# EAGLE design preamp (EAGLE 8.2.2)
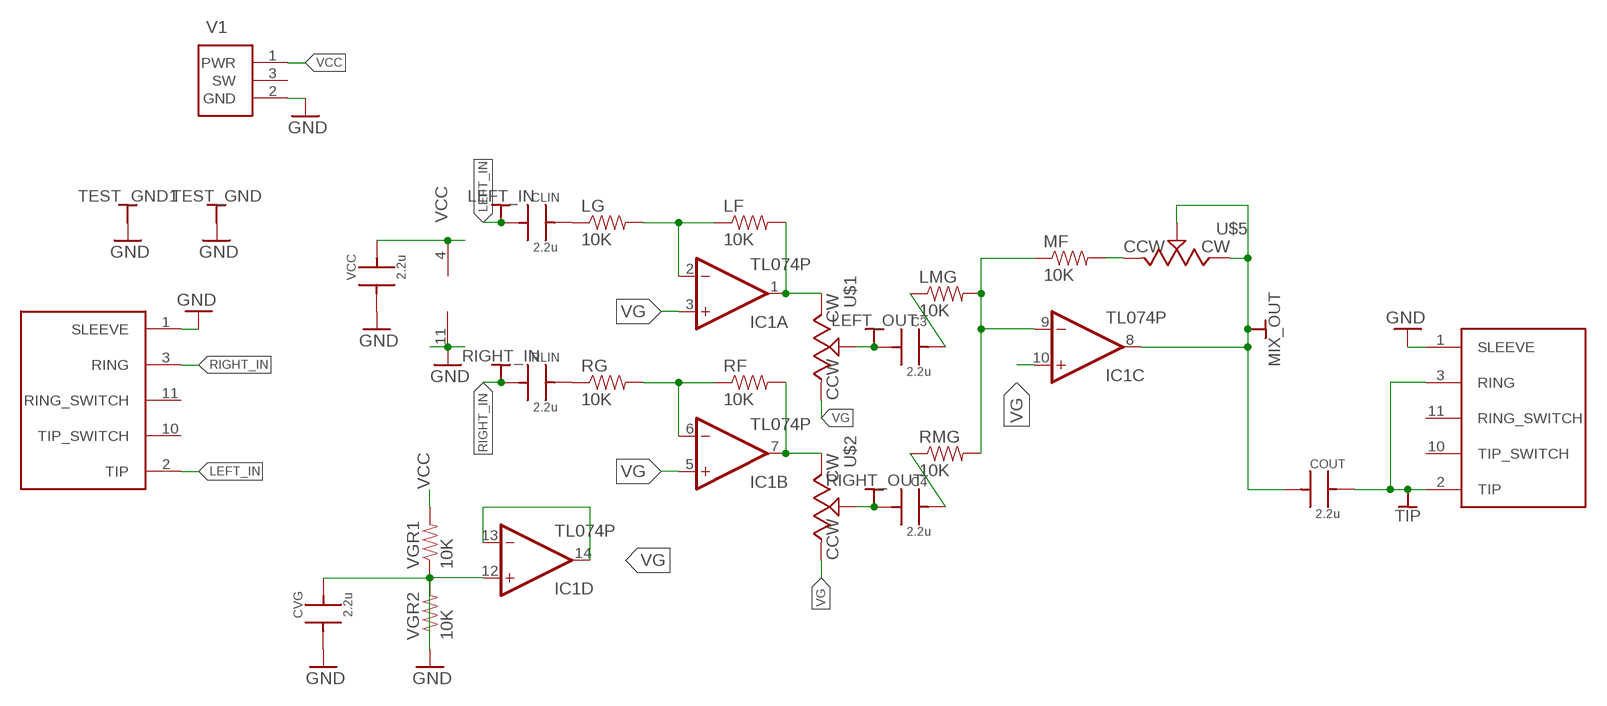
[diagram p0: schematic, sheet 1]

## Parts
C3  2.2u  CAP  [C322]
C4  2.2u  CAP  [C322]
CLIN  2.2u  CAP  [C322]
COUT  2.2u  CAP  [C322]
CVG  2.2u  CAP  [C322]
IC1  TL074P  [DIL14]
LEFT_IN  TEST_POINTMINIATURE  [PLATED_HOLE_1.02MM]
LEFT_OUT  TEST_POINTMINIATURE  [PLATED_HOLE_1.02MM]
LF  10K  RESISTORPTH-1/4W  [AXIAL-0.4]
LG  10K  RESISTORPTH-1/4W  [AXIAL-0.4]
LMG  10K  RESISTORPTH-1/4W  [AXIAL-0.4]
MF  10K  RESISTORPTH-1/4W  [AXIAL-0.4]
MIX_OUT  TEST_POINTMINIATURE  [PLATED_HOLE_1.02MM]
RF  10K  RESISTORPTH-1/4W  [AXIAL-0.4]
RG  10K  RESISTORPTH-1/4W  [AXIAL-0.4]
RIGHT_IN  TEST_POINTMINIATURE  [PLATED_HOLE_1.02MM]
RIGHT_OUT  TEST_POINTMINIATURE  [PLATED_HOLE_1.02MM]
RLIN  2.2u  CAP  [C322]
RMG  10K  RESISTORPTH-1/4W  [AXIAL-0.4]
TEST_GND  TEST_POINTMINIATURE  [PLATED_HOLE_1.02MM]
TEST_GND1  TEST_POINTMINIATURE  [PLATED_HOLE_1.02MM]
TIP  TEST_POINTMINIATURE  [PLATED_HOLE_1.02MM]
U$1  POTENTIOMETER3362P  [3362P]
U$2  POTENTIOMETER3362P  [3362P]
U$3  AUDIO_5_CONDUCTOR  [SJ1-3525N]
U$4  AUDIO_5_CONDUCTOR  [SJ1-3525N]
U$5  POTENTIOMETER3362P  [3362P]
V1  POWER_JACK  [PJ-102AH]
VCC  2.2u  CAP  [C322]
VGR1  10K  RESISTORPTH-1/4W  [AXIAL-0.4]
VGR2  10K  RESISTORPTH-1/4W  [AXIAL-0.4]

## Nets
GND: CVG.1 IC1.11(P:V-) TEST_GND1.1 TEST_GND.1 U$3.1(SLEEVE) U$4.1(SLEEVE) V1.2(GND) VCC.1 VGR2.P$2
LEFT_IN: CLIN.1 LEFT_IN.1 U$3.2(TIP)
N$1: IC1.2(A:-IN) LF.P$1 LG.P$2
N$2: IC1.6(B:-IN) RF.P$1 RG.P$2
N$3: IC1.7(B:OUT) RF.P$2 U$2.3(CW)
N$4: IC1.1(A:OUT) LF.P$2 U$1.3(CW)
N$5: RG.P$1 RLIN.2
N$6: CLIN.2 LG.P$1
N$7: CVG.2 IC1.12(D:+IN) VGR1.P$1 VGR2.P$1
N$8: C3.1 LEFT_OUT.1 U$1.2(WIPER)
N$9: C3.2 LMG.P$1
N$10: C4.2 RMG.P$1
N$11: IC1.9(C:-IN) LMG.P$2 MF.P$1 RMG.P$2
N$12: C4.1 RIGHT_OUT.1 U$2.2(WIPER)
N$13: COUT.1 IC1.8(C:OUT) MIX_OUT.1 U$5.2(WIPER) U$5.3(CW)
N$14: COUT.2 TIP.1 U$4.2(TIP) U$4.3(RING)
N$15: MF.P$2 U$5.1(CCW)
RIGHT_IN: RIGHT_IN.1 RLIN.1 U$3.3(RING)
VCC: IC1.4(P:V+) V1.1(PWR) VCC.2 VGR1.P$2
VG: IC1.3(A:+IN) IC1.5(B:+IN) IC1.10(C:+IN) IC1.13(D:-IN) IC1.14(D:OUT) U$1.1(CCW) U$2.1(CCW)
Unconnected: U$3.10(TIP_SWITCH) U$3.11(RING_SWITCH) U$4.10(TIP_SWITCH) U$4.11(RING_SWITCH)

## Power pins joined to a net without a drawn wire
SW: V1.3(SW)

## Library data of the parts
C3 C4 CLIN COUT CVG RLIN VCC = KEMET:CAP
IC1 = linear:TL074: OP AMP
LEFT_IN LEFT_OUT MIX_OUT RIGHT_IN RIGHT_OUT TEST_GND TEST_GND1 TIP = Keystone:TEST_POINT
LF LG LMG MF RF RG RMG VGR1 VGR2 = SparkFun-Passives:RESISTOR: Resistor Basic schematic elements and footprints for 0603, 1206, and PTH resistors.
U$1 U$2 U$5 = Bourns:POTENTIOMETER
U$3 U$4 = CUI:AUDIO_5_CONDUCTOR
V1 = CUI:POWER_JACK: Standard Power Jack with Switch

## Net classes
0 default: width 0.406 mm

## Board
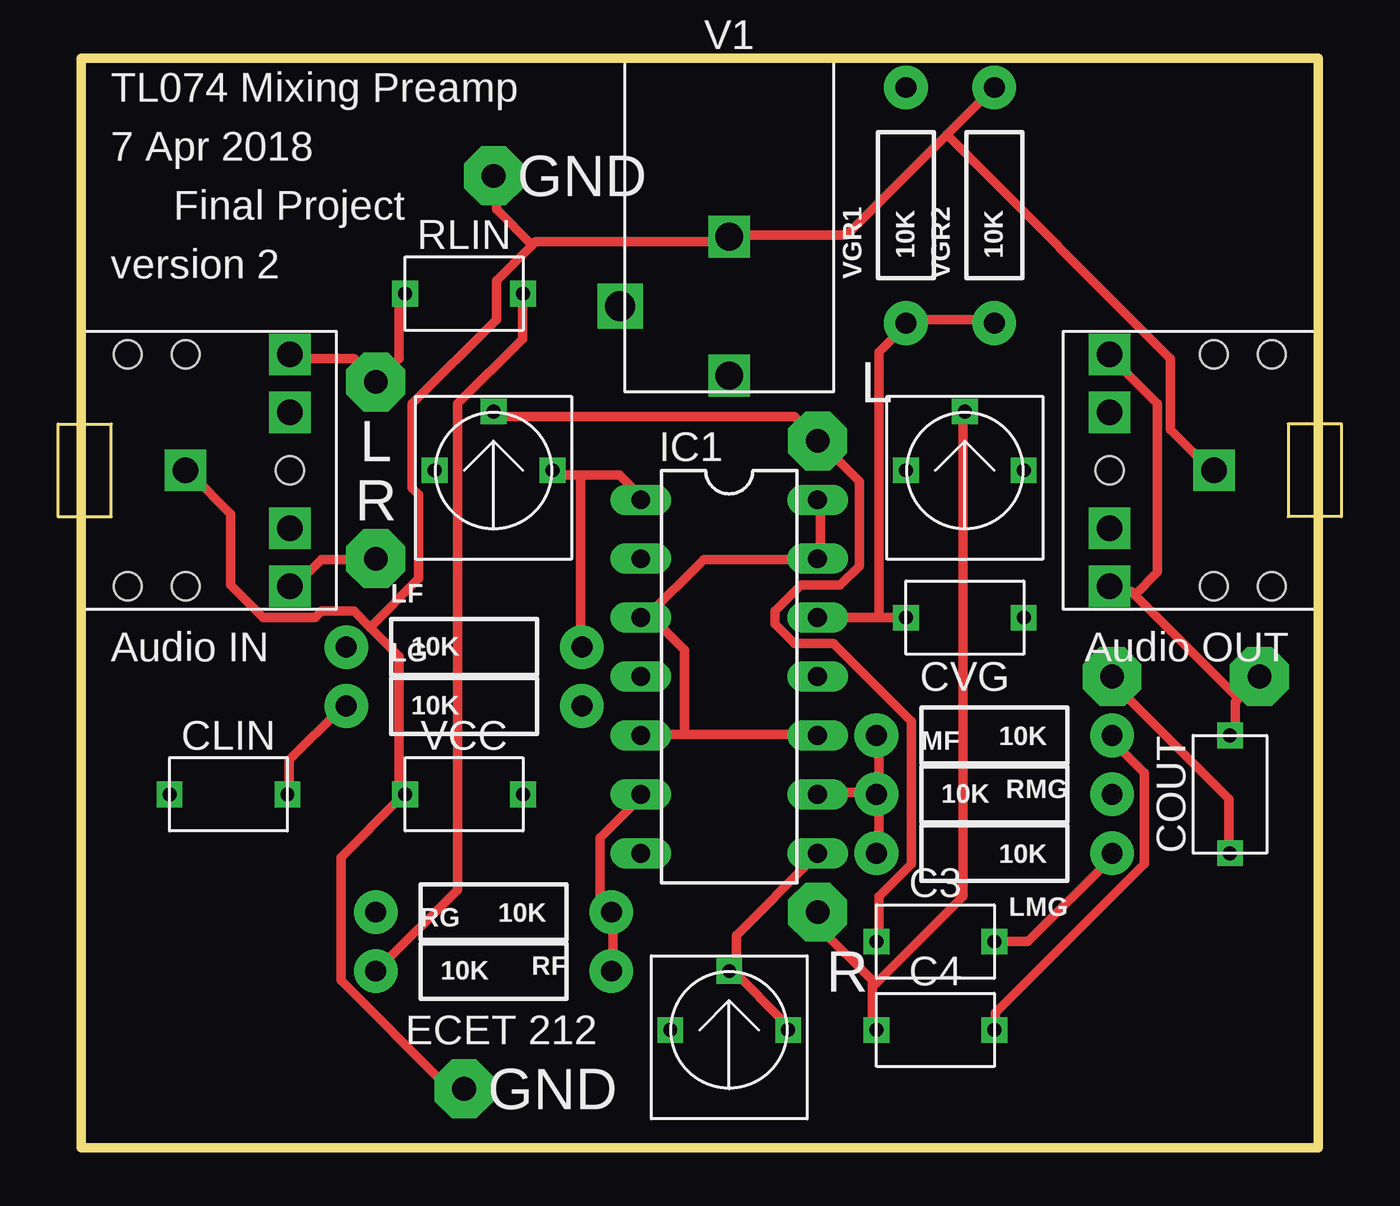
[diagram p1: board, top side]
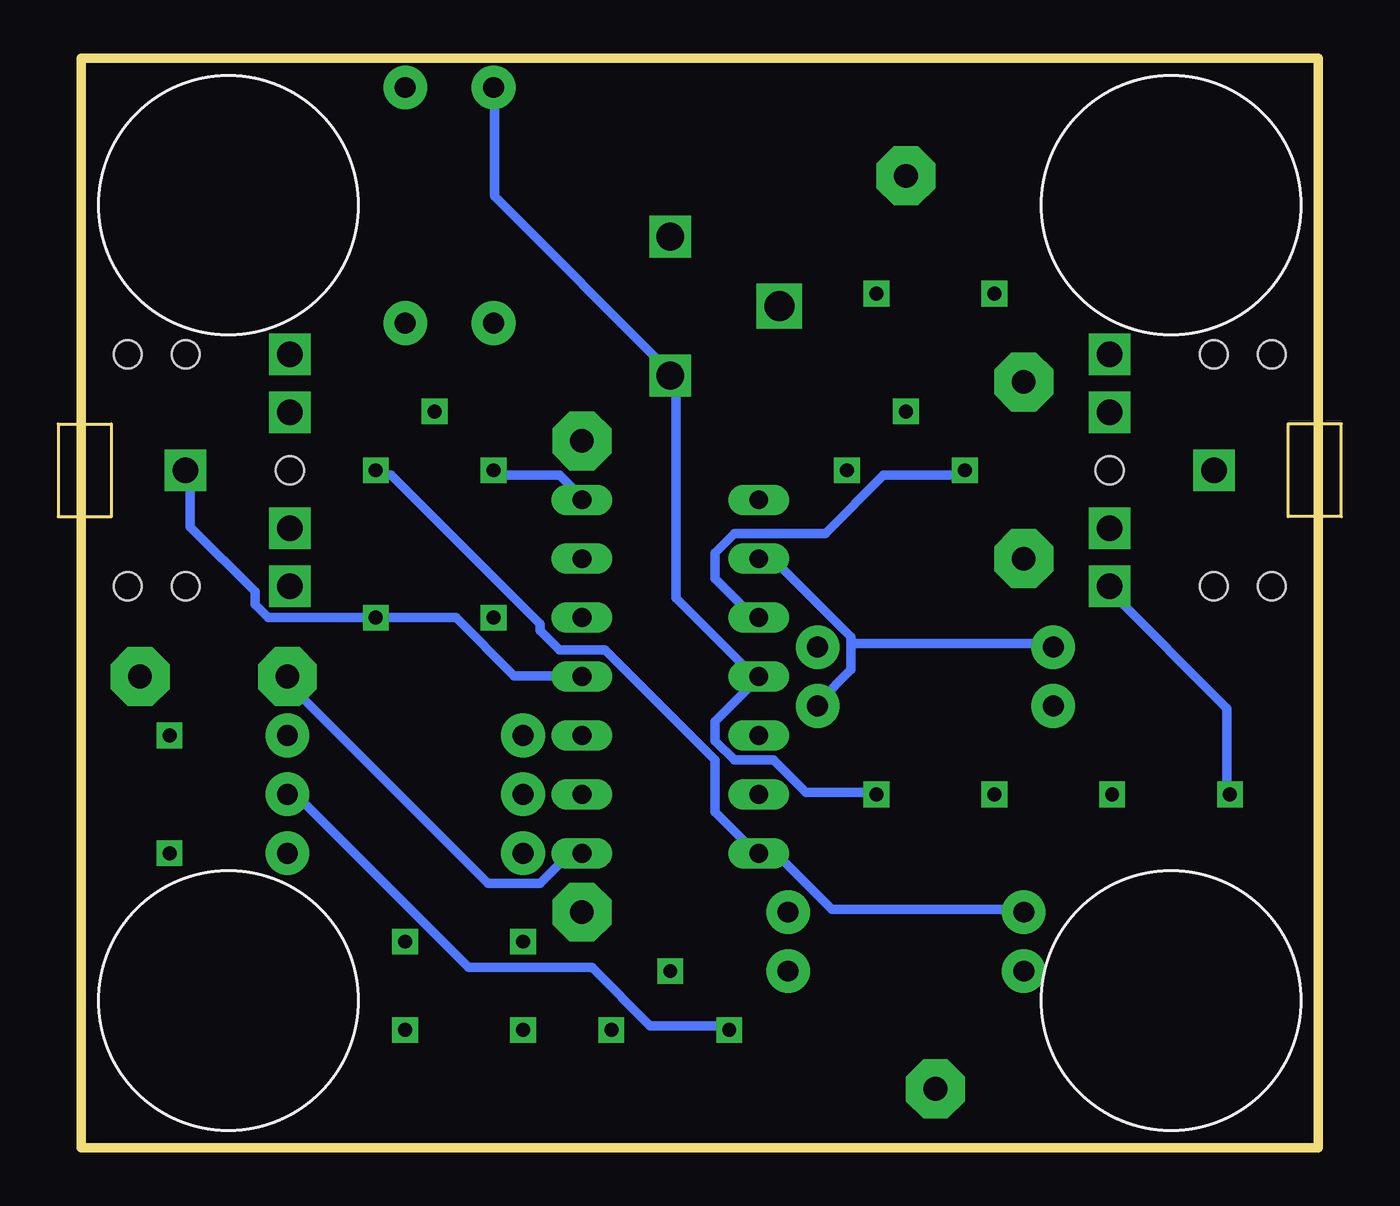
[diagram p2: board, bottom side, seen from below]

Size 53.34 x 46.99 mm. Coordinates in mm from the lower left corner, seen from the top.
Outline: 0,0 0,46.99 53.34,46.99 53.34,0 0,0
Copper layers (1*16): Top 0.035mm / dielectric 1.5mm / Bottom 0.035mm
Design rules "default": minimum track width 6mil, minimum drill 0.35mm, track to track 6mil, track to pad 6mil, pad to pad 6mil, via to via 6mil, smd to smd 6mil, copper to edge 40mil, drill to drill 6mil, minimum pad ring 10mil, minimum via ring 8mil, stop-mask expansion 4mil, vias tented up to drill 0mil, thermal gap 10mil

### Footprints (pad centres in the part's own frame; a part is rotated, then mirrored left to right if it is on the bottom)
C322 = drill 0.6 square: 1 -2.54,0; 2 2.54,0
DIL14 = drill 0.813 long: 1 -7.62,-3.81; 2 -5.08,-3.81; 3 -2.54,-3.81; 4 0,-3.81; 5 2.54,-3.81; 6 5.08,-3.81; 7 7.62,-3.81; 8 7.62,3.81; 9 5.08,3.81; 10 2.54,3.81; 11 0,3.81; 12 -2.54,3.81; 13 -5.08,3.81; 14 -7.62,3.81
PLATED_HOLE_1.02MM = drill 1.02 pad 2.54 octagon: 1 0,0
AXIAL-0.4 = drill 0.9 pad 1.88: P$1 -5.08,0; P$2 5.08,0
3362P = drill 0.6 square: 1 -2.54,0; 2 0,2.54; 3 2.54,0
SJ1-3525N = drill 1.1 pad 1.778 square: 1 0,-4.5; 2 -5,-9; 3 5,-9; 10 -2.5,-9; 11 2.5,-9 | hole 1.2: -5,-2; 5,-2; -5,-4.5; 5,-4.5; 0,-9
PJ-102AH = drill 1.2 square: 1 0,-13.7; 2 0,-7.7 | drill 1.3 square: 3 -4.7,-10.7

### Placement (x,y rotation side)
C3  36.83,8.89 0 top
C4  36.83,5.08 0 top
CLIN  6.35,15.24 0 top
COUT  49.53,15.24 90 top
CVG  38.1,22.86 180 top
IC1  27.94,20.32 270 top
LEFT_IN  12.7,25.4 0 top
LEFT_OUT  31.75,30.48 0 top
LF  16.51,21.59 0 top
LG  16.51,19.05 0 top
LMG  39.37,12.7 180 top
MF  39.37,15.24 0 top
MIX_OUT  44.45,20.32 0 top
RF  17.78,10.16 180 top
RG  17.78,7.62 0 top
RIGHT_IN  12.7,33.02 0 top
RIGHT_OUT  31.75,10.16 0 top
RLIN  16.51,36.83 0 top
RMG  39.37,17.78 180 top
TEST_GND  17.78,41.91 0 top
TEST_GND1  16.51,2.54 0 top
TIP  50.8,20.32 0 top
U$1  17.78,29.21 0 top
U$2  38.1,29.21 0 top
U$3  0,29.21 90 top
U$4  53.34,29.21 270 top
U$5  27.94,5.08 0 top
U$7  [SJ-5003]  46.99,40.64 0 bottom
U$8  [SJ-5003]  46.99,6.35 0 bottom
U$9  [SJ-5003]  6.35,40.64 0 bottom
U$10  [SJ-5003]  6.35,6.35 0 bottom
V1  27.94,46.99 0 top
VCC  16.51,15.24 0 top
VGR1  35.56,40.64 90 top
VGR2  39.37,40.64 90 top

### Tracks (layer width: path | path; a pad name or v marks a point on that pad's centre or on a via)
GND
  Top 0.406: 12.46,22.44 11.76,23.14 10.36,23.14 10.08,22.86 7.85,22.86 6.45,24.26 6.45,27.33 4.78,29.01 U$3.1 | 12.46,22.44 13.72,21.18 13.72,15.32 VCC.1 13.72,15.04 11.2,12.52 11.2,7.21 15.67,2.74 16.51,2.74 TEST_GND1.1 | VGR2.P$2 37.32,43.67 | 37.32,43.67 32.99,39.34 27.96,39.34 V1.2 27.69,39.06 19.58,39.06 19.44,38.92 | 37.32,43.67 46.96,34.04 46.96,30.96 48.64,29.29 U$4.1 | 12.46,22.44 14.55,24.54 14.55,28.17 14.27,28.45 14.27,32.08 17.91,35.71 17.91,37.39 19.44,38.92 | 19.44,38.92 17.91,40.46 17.91,41.86 TEST_GND.1
  Bottom 0.406: IC1.11 31.88,20.34 34.67,20.34 37.19,22.86 CVG.1 45.29,22.86 45.85,23.42 45.85,23.98 48.64,26.77 48.64,29.01 U$4.1
LEFT_IN
  Top 0.406: LEFT_IN.1 12.6,25.38 10.36,25.38 9.25,24.26 U$3.2
  Bottom 0.406: CLIN.1 3.94,15.32 3.94,18.95 8.97,23.98 U$3.2
N$1
  Bottom 0.406: 20.14,21.74 20.14,20.62 21.54,19.23 LG.P$2 | 20.14,21.74 20.14,22.02 23.49,25.38 24.05,25.38 IC1.2 | 20.14,21.74 11.48,21.74 LF.P$1
N$2
  Top 0.406: IC1.6 24.05,15.04 22.38,13.36 22.38,10.57 22.66,10.29 RF.P$1 22.94,10.01 22.94,7.77 RG.P$2
N$3
  Bottom 0.406: U$2.3 40.54,29.01 39.98,29.01 33.55,22.58 33.55,22.3 32.72,21.46 30.76,21.46 26.01,16.71 26.01,14.48 24.33,12.8 IC1.7 24.05,12.52 23.22,12.52 20.98,10.29 12.88,10.29 RF.P$2
N$4
  Top 0.406: 21.54,29.01 23.22,29.01 24.05,28.17 IC1.1 | 21.54,29.01 20.42,29.01 U$1.3 | 21.54,29.01 21.54,21.74 LF.P$2
N$5
  Top 0.406: RLIN.2 19.02,36.83 19.02,34.87 16.23,32.08 16.23,11.12 12.88,7.77 RG.P$1
N$6
  Top 0.406: CLIN.2 8.97,15.32 8.97,16.71 11.2,18.95 LG.P$1
N$7
  Top 0.406: IC1.12 34.39,22.86 | 34.39,22.86 CVG.2 | VGR2.P$1 39.14,35.71 35.79,35.71 VGR1.P$1 35.51,35.43 34.39,34.31 34.39,22.86
N$8
  Top 0.406: U$1.2 17.91,31.52 30.76,31.52 31.6,30.68 LEFT_OUT.1 31.88,30.4 33.55,28.73 33.55,25.09 32.72,24.26 31.04,24.26 29.92,23.14 29.92,22.58 30.76,21.74 32.44,21.74 35.79,18.39 35.79,12.24 34.39,10.85 34.39,8.89 C3.1
N$9
  Top 0.406: C3.2 40.82,8.89 44.45,12.52 LMG.P$1
N$10
  Top 0.406: C4.2 39.42,5.26 39.42,5.82 45.85,12.24 45.85,16.15 44.45,17.55 RMG.P$1
N$11
  Top 0.406: IC1.9 31.88,15.32 34.11,15.32 MF.P$1 | LMG.P$2 34.39,12.8 34.39,15.04 MF.P$1 | RMG.P$2 34.39,17.55 34.39,15.32 MF.P$1
N$12
  Top 0.406: 34.11,6.93 34.11,7.21 31.88,9.45 31.88,10.01 RIGHT_OUT.1 | 34.11,6.93 34.11,5.26 C4.1 | 34.11,6.93 38.02,10.85 38.02,31.52 U$2.2
N$13
  Top 0.406: U$5.3 30.48,5.26 27.96,7.77 U$5.2 28.24,7.77 28.24,9.17 31.6,12.52 IC1.8 | COUT.1 49.48,12.8 49.48,15.04 44.45,20.07 MIX_OUT.1
  Bottom 0.406: IC1.8 31.88,12.52 32.44,12.52 33.55,11.4 35.79,11.4 44.45,20.07 MIX_OUT.1
N$14
  Top 0.406: 49.9,19.37 50.6,20.07 TIP.1 | 49.9,19.37 49.76,19.23 49.76,17.83 COUT.2 | 49.9,19.37 45.43,23.84 | 45.43,23.84 45.29,23.98 44.45,23.98 U$4.3 | 45.43,23.84 46.41,24.82 46.41,32.08 44.45,34.04 U$4.2
N$15
  Bottom 0.406: U$5.1 25.45,5.26 28.8,5.26 31.32,7.77 36.63,7.77 43.89,15.04 44.45,15.04 MF.P$2
RIGHT_IN
  Top 0.406: RLIN.1 13.72,36.83 13.72,34.04 RIGHT_IN.1 12.6,33.2 11.76,34.04 9.25,34.04 U$3.3
VCC
  Bottom 0.406: VCC.2 19.3,15.32 22.1,15.32 23.49,16.71 25.17,16.71 26.01,17.55 26.01,18.39 24.33,20.07 IC1.4 24.33,20.34 27.69,23.7 27.69,33.2 V1.1 27.96,33.48 35.51,41.02 35.51,45.49 VGR1.P$2
VG
  Top 0.406: 26.01,17.83 31.6,17.83 IC1.10 | 26.01,17.83 24.33,17.83 IC1.5 | IC1.14 31.88,27.89 31.88,25.65 IC1.13 31.6,25.38 26.85,25.38 24.33,22.86 IC1.3 24.61,22.86 26.01,21.46 26.01,17.83
  Bottom 0.406: U$2.1 35.51,29.01 32.72,29.01 31.88,28.17 IC1.14 | U$1.1 15.39,29.01 18.74,29.01 21.26,26.49 25.17,26.49 26.01,25.65 26.01,24.54 24.33,22.86 IC1.3

### Text on the board
tPlace: TL074 Mixing Preamp | 7 Apr 2018 | GND | Final Project | version 2 | L | L | R | Audio IN | Audio OUT | R | ECET 212 | GND